# EAGLE schematic Yantronix_ECG_Base (EAGLE 5.10)
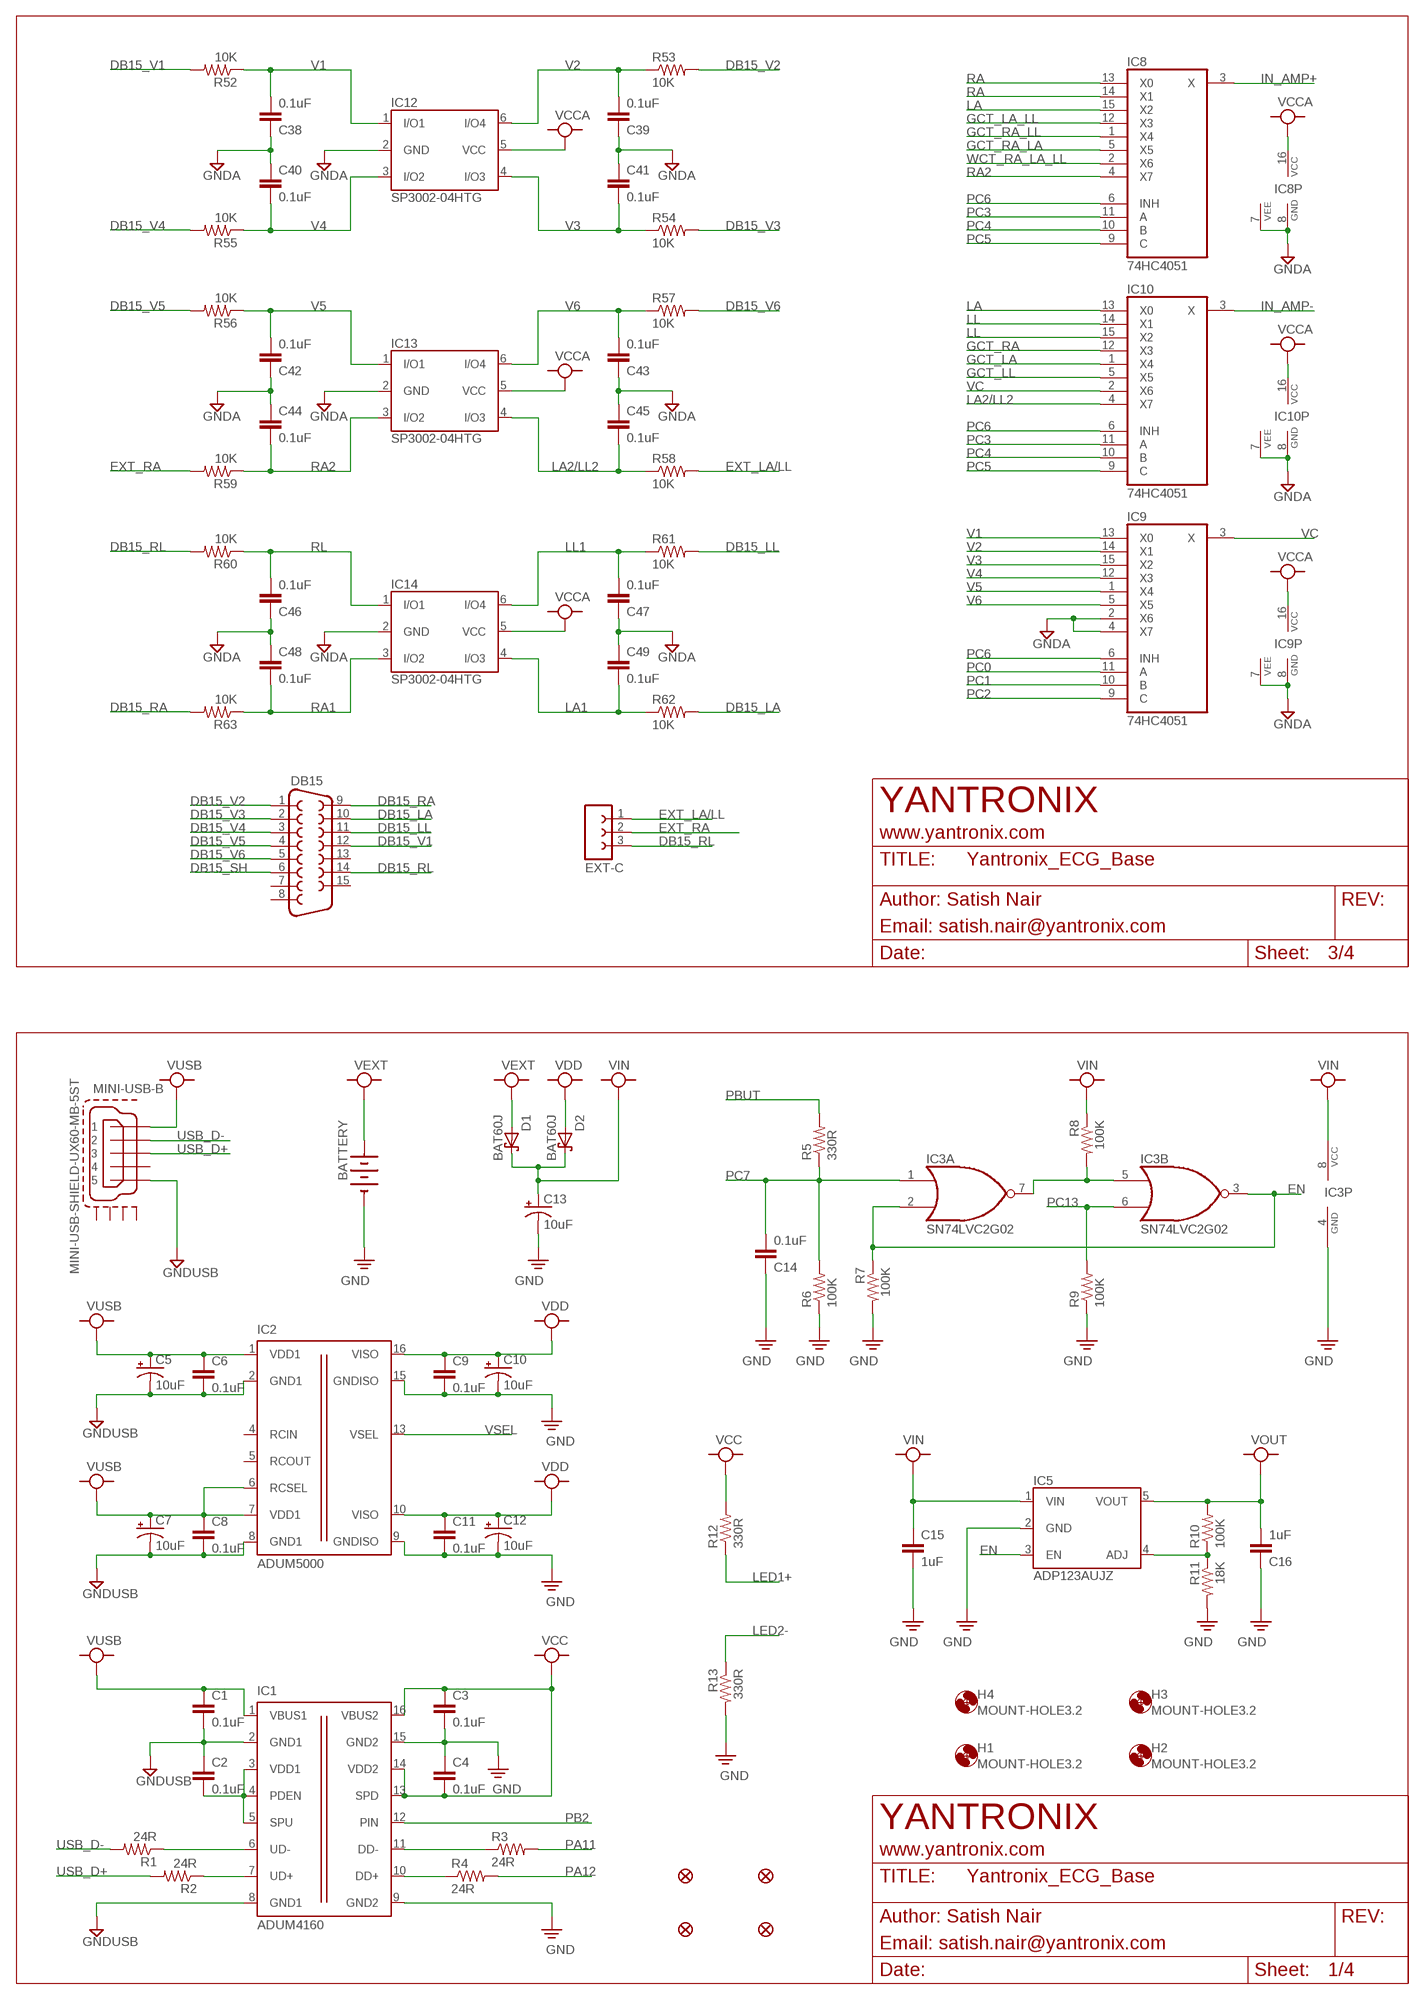
[diagram p0: schematic, sheet 1, part 1 of 2]
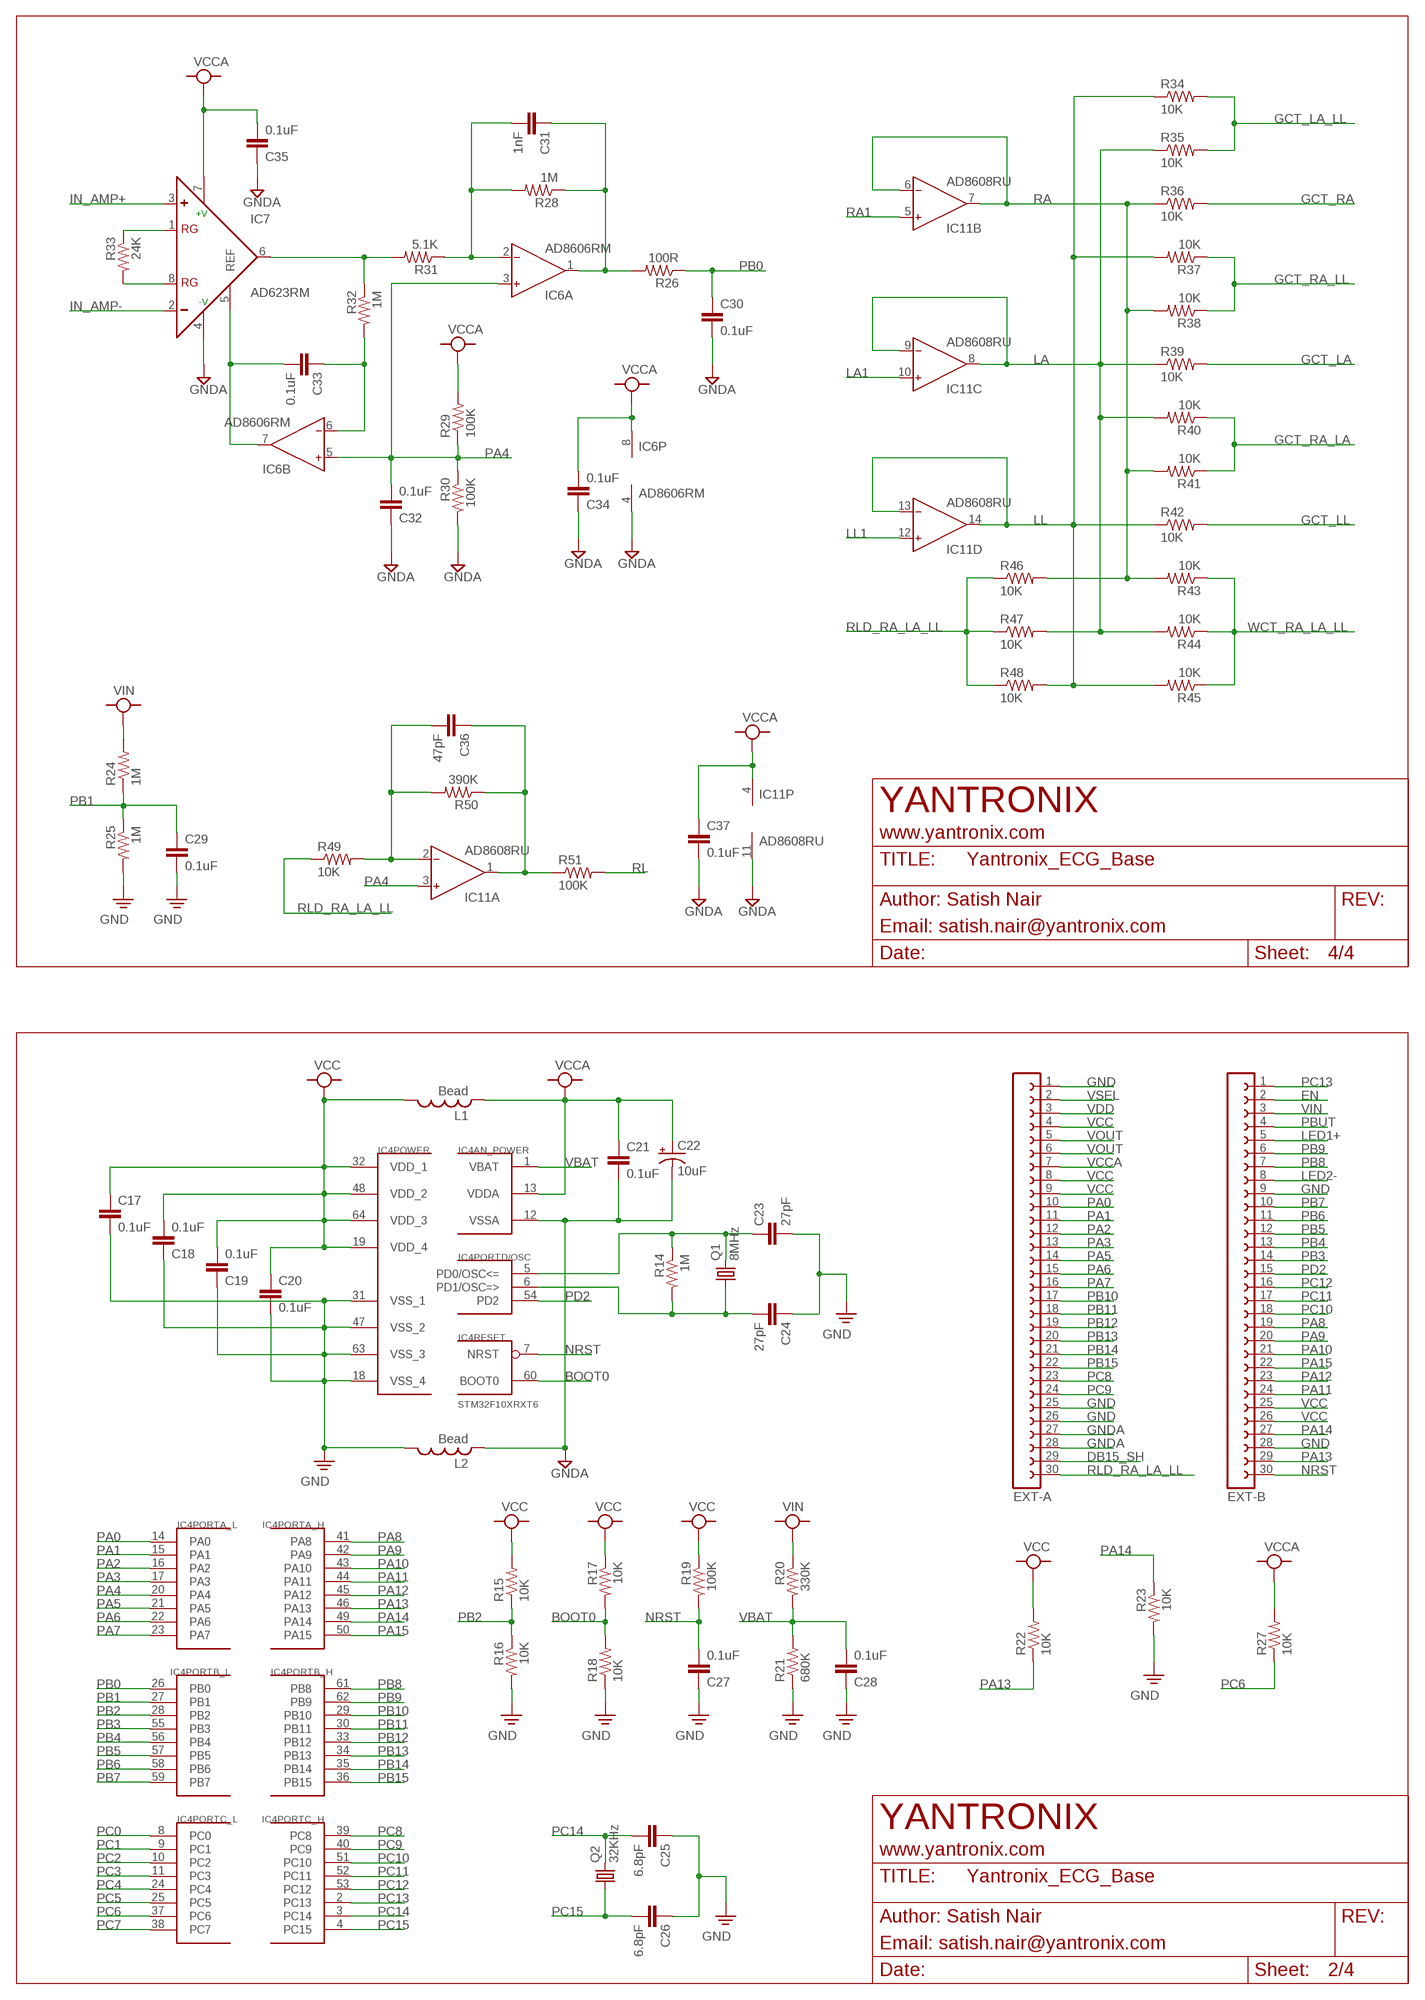
[diagram p1: schematic, sheet 1, part 2 of 2]

## Parts
BATTERY  BATTERY  [BATTERY]
C1  0.1uF  CAPACITOR0805  [0805]
C2  0.1uF  CAPACITOR0805  [0805]
C3  0.1uF  CAPACITOR0805  [0805]
C4  0.1uF  CAPACITOR0805  [0805]
C5  10uF  POL-CAPACITOR1206  [EIA3216]
C6  0.1uF  CAPACITOR0805  [0805]
C7  10uF  POL-CAPACITOR1206  [EIA3216]
C8  0.1uF  CAPACITOR0805  [0805]
C9  0.1uF  CAPACITOR0805  [0805]
C10  10uF  POL-CAPACITOR1206  [EIA3216]
C11  0.1uF  CAPACITOR0805  [0805]
C12  10uF  POL-CAPACITOR1206  [EIA3216]
C13  10uF  POL-CAPACITOR1206  [EIA3216]
C14  0.1uF  CAPACITOR0805  [0805]
C15  1uF  CAPACITOR0805  [0805]
C16  1uF  CAPACITOR0805  [0805]
C17  0.1uF  CAPACITOR0805  [0805]
C18  0.1uF  CAPACITOR0805  [0805]
C19  0.1uF  CAPACITOR0805  [0805]
C20  0.1uF  CAPACITOR0805  [0805]
C21  0.1uF  CAPACITOR0805  [0805]
C22  10uF  POL-CAPACITOR1206  [EIA3216]
C23  27pF  CAPACITOR0805  [0805]
C24  27pF  CAPACITOR0805  [0805]
C25  6.8pF  CAPACITOR0805  [0805]
C26  6.8pF  CAPACITOR0805  [0805]
C27  0.1uF  CAPACITOR0805  [0805]
C28  0.1uF  CAPACITOR0805  [0805]
C29  0.1uF  CAPACITOR0805  [0805]
C30  0.1uF  CAPACITOR0805  [0805]
C31  1nF  CAPACITOR0805  [0805]
C32  0.1uF  CAPACITOR0805  [0805]
C33  0.1uF  CAPACITOR0805  [0805]
C34  0.1uF  CAPACITOR0805  [0805]
C35  0.1uF  CAPACITOR0805  [0805]
C36  47pF  CAPACITOR0805  [0805]
C37  0.1uF  CAPACITOR0805  [0805]
C38  0.1uF  CAPACITOR0805  [0805]
C39  0.1uF  CAPACITOR0805  [0805]
C40  0.1uF  CAPACITOR0805  [0805]
C41  0.1uF  CAPACITOR0805  [0805]
C42  0.1uF  CAPACITOR0805  [0805]
C43  0.1uF  CAPACITOR0805  [0805]
C44  0.1uF  CAPACITOR0805  [0805]
C45  0.1uF  CAPACITOR0805  [0805]
C46  0.1uF  CAPACITOR0805  [0805]
C47  0.1uF  CAPACITOR0805  [0805]
C48  0.1uF  CAPACITOR0805  [0805]
C49  0.1uF  CAPACITOR0805  [0805]
D1  BAT60J  [SOD-323]
D2  BAT60J  [SOD-323]
DB15  F15H  [F15H]
EXT-A  FE30-1  [FE30]
EXT-B  FE30-1  [FE30]
EXT-C  FE03-1  [FE03]
H1  MOUNT-HOLE3.2  [3,2]
H2  MOUNT-HOLE3.2  [3,2]
H3  MOUNT-HOLE3.2  [3,2]
H4  MOUNT-HOLE3.2  [3,2]
IC1  ADUM4160  [SO-16W]
IC2  ADUM5000  [RW-16]
IC3  SN74LVC2G02  [DCT_R-PDSO-G8]
IC4  STM32F10XRXT6  [TQFP64]
IC5  ADP123AUJZ  [SOT23-5]
IC6  AD8606RM  [MSOP08]
IC7  AD623RM  [MSOP08]
IC8  74HC4051  4051PW  [TSSOP16]
IC9  74HC4051  4051PW  [TSSOP16]
IC10  74HC4051  4051PW  [TSSOP16]
IC11  AD8608RU  [TSSOP14]
IC12  SP3002-04HTG  [SOT23-6]
IC13  SP3002-04HTG  [SOT23-6]
IC14  SP3002-04HTG  [SOT23-6]
JP1  FIDUCIAL1.5X3  [FIDUCIAL-1.5X3]
JP2  FIDUCIAL1.5X3  [FIDUCIAL-1.5X3]
JP3  FIDUCIAL1.5X3  [FIDUCIAL-1.5X3]
JP4  FIDUCIAL1.5X3  [FIDUCIAL-1.5X3]
L1  Bead  INDUCTOR0805  [0805]
L2  Bead  INDUCTOR0805  [0805]
MINI-USB-B  MINI-USB-SHIELD-UX60-MB-5ST  [UX60-MB-5ST]
Q1  8MHz  CRYSTALHC49S  [HC49/S]
Q2  32KHz  CRYSTALTC26H  [TC26H]
R1  24R  RESISTOR0805  [0805]
R2  24R  RESISTOR0805  [0805]
R3  24R  RESISTOR0805  [0805]
R4  24R  RESISTOR0805  [0805]
R5  330R  RESISTOR0805  [0805]
R6  100K  RESISTOR0805  [0805]
R7  100K  RESISTOR0805  [0805]
R8  100K  RESISTOR0805  [0805]
R9  100K  RESISTOR0805  [0805]
R10  100K  RESISTOR0805  [0805]
R11  18K  RESISTOR0805  [0805]
R12  330R  RESISTOR0805  [0805]
R13  330R  RESISTOR0805  [0805]
R14  1M  RESISTOR0805  [0805]
R15  10K  RESISTOR0805  [0805]
R16  10K  RESISTOR0805  [0805]
R17  10K  RESISTOR0805  [0805]
R18  10K  RESISTOR0805  [0805]
R19  100K  RESISTOR0805  [0805]
R20  330K  RESISTOR0805  [0805]
R21  680K  RESISTOR0805  [0805]
R22  10K  RESISTOR0805  [0805]
R23  10K  RESISTOR0805  [0805]
R24  1M  RESISTOR0805  [0805]
R25  1M  RESISTOR0805  [0805]
R26  100R  RESISTOR0805  [0805]
R27  10K  RESISTOR0805  [0805]
R28  1M  RESISTOR0805  [0805]
R29  100K  RESISTOR0805  [0805]
R30  100K  RESISTOR0805  [0805]
R31  5.1K  RESISTOR0805  [0805]
R32  1M  RESISTOR0805  [0805]
R33  24K  RESISTOR0805  [0805]
R34  10K  RESISTOR0805  [0805]
R35  10K  RESISTOR0805  [0805]
R36  10K  RESISTOR0805  [0805]
R37  10K  RESISTOR0805  [0805]
R38  10K  RESISTOR0805  [0805]
R39  10K  RESISTOR0805  [0805]
R40  10K  RESISTOR0805  [0805]
R41  10K  RESISTOR0805  [0805]
R42  10K  RESISTOR0805  [0805]
R43  10K  RESISTOR0805  [0805]
R44  10K  RESISTOR0805  [0805]
R45  10K  RESISTOR0805  [0805]
R46  10K  RESISTOR0805  [0805]
R47  10K  RESISTOR0805  [0805]
R48  10K  RESISTOR0805  [0805]
R49  10K  RESISTOR0805  [0805]
R50  390K  RESISTOR0805  [0805]
R51  100K  RESISTOR0805  [0805]
R52  10K  RESISTOR1206  [1206]
R53  10K  RESISTOR1206  [1206]
R54  10K  RESISTOR1206  [1206]
R55  10K  RESISTOR1206  [1206]
R56  10K  RESISTOR1206  [1206]
R57  10K  RESISTOR1206  [1206]
R58  10K  RESISTOR1206  [1206]
R59  10K  RESISTOR1206  [1206]
R60  10K  RESISTOR1206  [1206]
R61  10K  RESISTOR1206  [1206]
R62  10K  RESISTOR1206  [1206]
R63  10K  RESISTOR1206  [1206]

## Nets
BOOT0: IC4.60(RESET:BOOT0) R17.2 R18.2
DB15_LA: DB15.10 R62.2
DB15_LL: DB15.11 R61.2
DB15_RA: DB15.9 R63.2
DB15_RL: DB15.14 EXT-C.3 R60.2
DB15_SH: DB15.6 EXT-A.29
DB15_V1: DB15.12 R52.2
DB15_V2: DB15.1 R53.2
DB15_V3: DB15.2 R54.2
DB15_V4: DB15.3 R55.2
DB15_V5: DB15.4 R56.2
DB15_V6: DB15.5 R57.2
EN: EXT-B.2 IC3.2(A:I2) IC3.3(B:O) IC5.3(EN) R7.1
EXT_LA/LL: EXT-C.1 R58.2
EXT_RA: EXT-C.2 R59.2
GCT_LA: IC10.1(X4) R39.2
GCT_LA_LL: IC8.12(X3) R34.2 R35.2
GCT_LL: IC10.5(X5) R42.2
GCT_RA: IC10.12(X3) R36.2
GCT_RA_LA: IC8.5(X5) R40.1 R41.1
GCT_RA_LL: IC8.1(X4) R37.1 R38.1
GND: BATTERY.- C3.2 C4.1 C9.2 C10.C(-) C11.2 C12.C(-) C13.C(-) C14.1 C15.2 C16.1 C17.2 C18.1 C19.1 C20.2 C23.2 C24.1 C25.1 C26.1 C27.1 C28.1 C29.2 EXT-A.1 EXT-A.25 EXT-A.26 EXT-B.9 EXT-B.28 IC1.9(GND2) IC1.15(GND2) IC2.9(GNDISO) IC2.15(GNDISO) IC3.4(P:GND) IC4.18(POWER:VSS_4) IC4.31(POWER:VSS_1) IC4.47(POWER:VSS_2) IC4.63(POWER:VSS_3) IC5.2(GND) L2.2 R6.1 R7.2 R9.1 R11.2 R13.2 R16.2 R18.1 R21.1 R23.2 R25.2
GNDA: C21.2 C22.C(-) C30.2 C32.1 C34.1 C35.1 C37.2 C38.1 C39.1 C40.1 C41.1 C42.1 C43.1 C44.1 C45.1 C46.1 C47.1 C48.1 C49.1 EXT-A.27 EXT-A.28 IC4.12(AN_POWER:VSSA) IC6.4(P:V-) IC7.4(-V) IC8.7(VEE) IC8.8(GND) IC9.2(X6) IC9.4(X7) IC9.7(VEE) IC9.8(GND) IC10.7(VEE) IC10.8(GND) IC11.11(P:V-) IC12.2(GND) IC13.2(GND) IC14.2(GND) L2.1 R30.2
GNDUSB: C1.2 C2.1 C5.C(-) C6.2 C7.C(-) C8.2 IC1.2(GND1) IC1.8(GND1) IC2.2(GND1) IC2.8(GND1) MINI-USB-B.5
IN_AMP+: IC7.3(+) IC8.3(X)
IN_AMP-: IC7.2(-) IC10.3(X)
LA: IC8.15(X2) IC10.13(X0) IC11.8(C:OUT) IC11.9(C:IN-) R35.1 R39.1 R40.2 R44.2 R47.2
LA1: C49.2 IC11.10(C:IN+) IC14.4(I/O3) R62.1
LA2/LL2: C45.2 IC10.4(X7) IC13.4(I/O3) R58.1
LED1+: EXT-B.5 R12.1
LED2-: EXT-B.8 R13.1
LL: IC10.14(X1) IC10.15(X2) IC11.13(D:IN-) IC11.14(D:OUT) R34.1 R37.2 R42.1 R45.2 R48.2
LL1: C47.2 IC11.12(D:IN+) IC14.6(I/O4) R61.1
N$1: C33.2 IC6.7(B:OUT) IC7.5(REF)
N$2: IC7.1(RG) R33.1
N$3: IC7.8(RG) R33.2
N$4: IC1.6(UD-) R1.1
N$5: C2.2 IC1.3(VDD1) IC1.4(PDEN) IC1.5(SPU)
N$6: IC1.7(UD+) R2.1
N$7: IC5.4(ADJ) R10.1 R11.1
N$9: C36.2 IC11.2(A:IN-) R49.2 R50.2
N$10: C36.1 IC11.1(A:OUT) R50.1 R51.1
N$11: IC7.6(OUT) R31.2 R32.1
N$12: C31.2 IC6.2(A:IN-) R28.2 R31.1
N$13: C33.1 IC6.6(B:IN-) R32.2
N$14: IC1.11(DD-) R3.1
N$15: IC1.10(DD+) R4.1
N$16: C31.1 IC6.1(A:OUT) R26.2 R28.1
N$17: IC3.5(B:I1) IC3.7(A:O) R8.2
N$28: C24.2 IC4.6(PORTD/OSC:PD1/OSC=>) Q1.1 R14.2
N$30: C23.1 IC4.5(PORTD/OSC:PD0/OSC<=) Q1.2 R14.1
NRST: C27.2 EXT-B.30 IC4.7(RESET:NRST) R19.2
PA0: EXT-A.10 IC4.14(PORTA_L:PA0)
PA1: EXT-A.11 IC4.15(PORTA_L:PA1)
PA2: EXT-A.12 IC4.16(PORTA_L:PA2)
PA3: EXT-A.13 IC4.17(PORTA_L:PA3)
PA4: C32.2 IC4.20(PORTA_L:PA4) IC6.3(A:IN+) IC6.5(B:IN+) IC11.3(A:IN+) R29.1 R30.1
PA5: EXT-A.14 IC4.21(PORTA_L:PA5)
PA6: EXT-A.15 IC4.22(PORTA_L:PA6)
PA7: EXT-A.16 IC4.23(PORTA_L:PA7)
PA8: EXT-B.19 IC4.41(PORTA_H:PA8)
PA9: EXT-B.20 IC4.42(PORTA_H:PA9)
PA10: EXT-B.21 IC4.43(PORTA_H:PA10)
PA11: EXT-B.24 IC4.44(PORTA_H:PA11) R3.2
PA12: EXT-B.23 IC4.45(PORTA_H:PA12) R4.2
PA13: EXT-B.29 IC4.46(PORTA_H:PA13) R22.1
PA14: EXT-B.27 IC4.49(PORTA_H:PA14) R23.1
PA15: EXT-B.22 IC4.50(PORTA_H:PA15)
PB0: C30.1 IC4.26(PORTB_L:PB0) R26.1
PB1: C29.1 IC4.27(PORTB_L:PB1) R24.1 R25.1
PB2: IC1.12(PIN) IC4.28(PORTB_L:PB2) R15.1 R16.1
PB3: EXT-B.14 IC4.55(PORTB_L:PB3)
PB4: EXT-B.13 IC4.56(PORTB_L:PB4)
PB5: EXT-B.12 IC4.57(PORTB_L:PB5)
PB6: EXT-B.11 IC4.58(PORTB_L:PB6)
PB7: EXT-B.10 IC4.59(PORTB_L:PB7)
PB8: EXT-B.7 IC4.61(PORTB_H:PB8)
PB9: EXT-B.6 IC4.62(PORTB_H:PB9)
PB10: EXT-A.17 IC4.29(PORTB_H:PB10)
PB11: EXT-A.18 IC4.30(PORTB_H:PB11)
PB12: EXT-A.19 IC4.33(PORTB_H:PB12)
PB13: EXT-A.20 IC4.34(PORTB_H:PB13)
PB14: EXT-A.21 IC4.35(PORTB_H:PB14)
PB15: EXT-A.22 IC4.36(PORTB_H:PB15)
PBUT: EXT-B.4 R5.2
PC0: IC4.8(PORTC_L:PC0) IC9.11(A)
PC1: IC4.9(PORTC_L:PC1) IC9.10(B)
PC2: IC4.10(PORTC_L:PC2) IC9.9(C)
PC3: IC4.11(PORTC_L:PC3) IC8.11(A) IC10.11(A)
PC4: IC4.24(PORTC_L:PC4) IC8.10(B) IC10.10(B)
PC5: IC4.25(PORTC_L:PC5) IC8.9(C) IC10.9(C)
PC6: IC4.37(PORTC_L:PC6) IC8.6(INH) IC9.6(INH) IC10.6(INH) R27.1
PC7: C14.2 IC3.1(A:I1) IC4.38(PORTC_L:PC7) R5.1 R6.2
PC8: EXT-A.23 IC4.39(PORTC_H:PC8)
PC9: EXT-A.24 IC4.40(PORTC_H:PC9)
PC10: EXT-B.18 IC4.51(PORTC_H:PC10)
PC11: EXT-B.17 IC4.52(PORTC_H:PC11)
PC12: EXT-B.16 IC4.53(PORTC_H:PC12)
PC13: EXT-B.1 IC3.6(B:I2) IC4.2(PORTC_H:PC13) R9.2
PC14: C25.2 IC4.3(PORTC_H:PC14) Q2.2
PC15: C26.2 IC4.4(PORTC_H:PC15) Q2.1
PD2: EXT-B.15 IC4.54(PORTD/OSC:PD2)
RA: IC8.13(X0) IC8.14(X1) IC11.6(B:IN-) IC11.7(B:OUT) R36.1 R38.2 R41.2 R43.2 R46.2
RA1: C48.2 IC11.5(B:IN+) IC14.3(I/O2) R63.1
RA2: C44.2 IC8.4(X7) IC13.3(I/O2) R59.1
RL: C46.2 IC14.1(I/O1) R51.2 R60.1
RLD_RA_LA_LL: EXT-A.30 R46.1 R47.1 R48.1 R49.1
USB_D+: MINI-USB-B.3 R2.2
USB_D-: MINI-USB-B.2 R1.2
V1: C38.2 IC9.13(X0) IC12.1(I/O1) R52.1
V2: C39.2 IC9.14(X1) IC12.6(I/O4) R53.1
V3: C41.2 IC9.15(X2) IC12.4(I/O3) R54.1
V4: C40.2 IC9.12(X3) IC12.3(I/O2) R55.1
V5: C42.2 IC9.1(X4) IC13.1(I/O1) R56.1
V6: C43.2 IC9.5(X5) IC13.6(I/O4) R57.1
VBAT: C28.2 IC4.1(AN_POWER:VBAT) R20.2 R21.2
VC: IC9.3(X) IC10.2(X6)
VCC: C3.1 C4.2 C17.1 C18.2 C19.2 C20.1 EXT-A.4 EXT-A.8 EXT-A.9 EXT-B.25 EXT-B.26 IC1.13(SPD) IC1.14(VDD2) IC1.16(VBUS2) IC4.19(POWER:VDD_4) IC4.32(POWER:VDD_1) IC4.48(POWER:VDD_2) IC4.64(POWER:VDD_3) L1.2 R12.2 R15.2 R17.1 R19.1 R22.2
VCCA: C21.1 C22.A(+) C34.2 C35.2 C37.1 EXT-A.7 IC4.13(AN_POWER:VDDA) IC6.8(P:V+) IC7.7(+V) IC8.16(VCC) IC9.16(VCC) IC10.16(VCC) IC11.4(P:V+) IC12.5(VCC) IC13.5(VCC) IC14.5(VCC) L1.1 R27.2 R29.2
VDD: C9.1 C10.A(+) C11.1 C12.A(+) D2.A EXT-A.3 IC2.10(VISO) IC2.16(VISO)
VEXT: BATTERY.+ D1.A
VIN: C13.A(+) C15.1 D1.K D2.K EXT-B.3 IC3.8(P:VCC) IC5.1(VIN) R8.1 R20.1 R24.2
VOUT: C16.2 EXT-A.5 EXT-A.6 IC5.5(VOUT) R10.2
VSEL: EXT-A.2 IC2.13(VSEL)
VUSB: C1.1 C5.A(+) C6.1 C7.A(+) C8.1 IC1.1(VBUS1) IC2.1(VDD1) IC2.6(RCSEL) IC2.7(VDD1) MINI-USB-B.1
WCT_RA_LA_LL: IC8.2(X6) R43.1 R44.1 R45.1
Unconnected: DB15.7 DB15.8 DB15.13 DB15.15 IC2.4(RCIN) IC2.5(RCOUT) MINI-USB-B.4 MINI-USB-B.M1(S1) MINI-USB-B.M2(S2) MINI-USB-B.M3(S3) MINI-USB-B.M4(S4)

## Notes on the sheet
- 3/4 | 4/4
- 1/4 | 2/4

## Library data of the parts
BATTERY = yantronix:BATTERY: NC ACCU Varta
C1-C4 C6 C8 C9 C11 C14-C21 C23-C49 = yantronix:CAPACITOR: Capacitor Standard 0603, 0805 and 1206 ceramic smd capacitors.
C5 C7 C10 C12 C13 C22 = yantronix:POL-CAPACITOR: Capacitor Polarized Standard 1206 SMD capacitor. Normally 10uF, 47uF, and 100uF in electrolytic and tantalum varieties.
D1 D2 = yantronix:BAT60J: SMALL SIGNAL SCHOTTKY DIODE
DB15 = yantronix:F15: SUB-D
EXT-A EXT-B = yantronix:FE30-1: FEMALE HEADER
EXT-C = yantronix:FE03-1: FEMALE HEADER
H1-H4 = yantronix:MOUNT-HOLE: MOUNTING HOLE with drill center marker
IC1 = yantronix:ADUM4160: Full/Low Speed 5 kV USB Digital Isolator
IC2 = yantronix:ADUM5000: 2.5 kV, Isolated DC-to-DC Converter
IC3 = yantronix:SN74LVC2G02: DUAL 2-INPUT POSITIVE-NOR GATE
IC4 = yantronix:STM32F10XRXT6: STM32F101/103 64pin LQFP
IC5 = yantronix:ADP123: 5.5 V Input, 300 mA, Low Quiescent Current, CMOS Linear Regulator
IC6 = yantronix:AD8606: Precision, Low Noise, CMOS, Rail-to-Rail, Input/Output Operational Amplifiers
IC7 = yantronix:AD623: Single-Supply, Rail-to-Rail, Low Cost Instrumentation Amplifier Source: http://www.analog.com/static/imported-files/data_sheets/AD623.pdf
IC8-IC10 = yantronix:4051: 8-channel ANALOG MULTIPLEXER
IC11 = yantronix:AD8608: Precision, Low Noise, CMOS, Rail-to-Rail, Input/Output Operational Amplifiers
IC12-IC14 = yantronix:SP3002-04: Very low capacitance ESD protection
JP1-JP4 = yantronix:FIDUCIAL: Fiducial Alignment Points Fiducial point for machine vision alignment.
L1 L2 = yantronix:INDUCTOR: Inductors Standard 0603, 0805 and 1206 smd inductors/ferrite beads.
MINI-USB-B = yantronix:MINI-USB-SHIELD-: MINI USB Connector Source: http://www.hirose.co.jp/cataloge_hp/e24000019.pdf
Q1 Q2 = yantronix:CRYSTAL: CRYSTAL
R1-R63 = yantronix:RESISTOR: Resistor Standard 0603, 0805 and 1206 smd resistors.